# Altium schematic sheet Connectors.SchDoc
size 420 x 297 mm
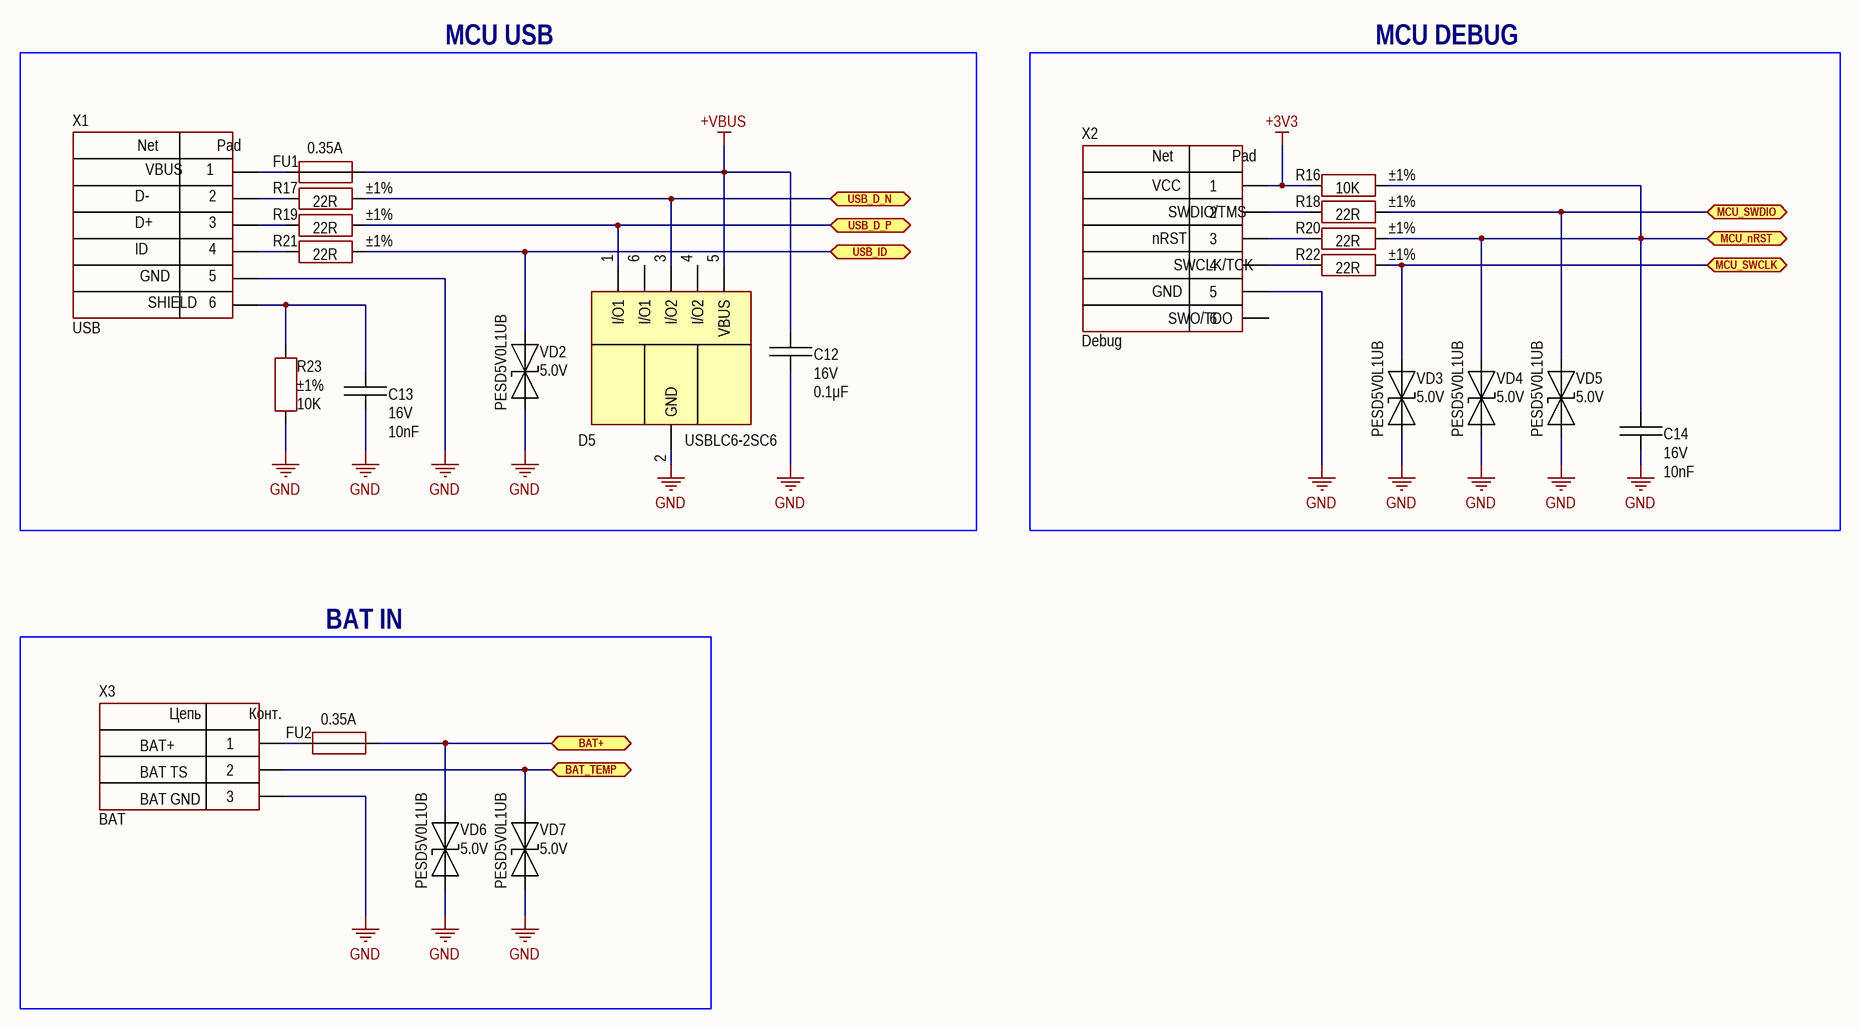
[diagram p0: Connectors.SchDoc]

## Parts
C12  value 0.1μF  Voltage: 16V  [CAP: 0402_NO_SILK]
C13  value 10nF  Voltage: 16V  [CAP: 0201]
C14  value 10nF  Voltage: 16V  [CAP: 0201]
D5  (no value)  [SOT23-6]
FU1  MaxCurrent: 0.35A  [FUSE 0402]
FU2  MaxCurrent: 0.35A  [FUSE 0402]
R16  value 10K  Tolerance: ±1%  [RES: 0201]
R17  value 22R  Tolerance: ±1%  [RES: 0201]
R18  value 22R  Tolerance: ±1%  [RES: 0201]
R19  value 22R  Tolerance: ±1%  [RES: 0201]
R20  value 22R  Tolerance: ±1%  [RES: 0201]
R21  value 22R  Tolerance: ±1%  [RES: 0201]
R22  value 22R  Tolerance: ±1%  [RES: 0201]
R23  value 10K  Tolerance: ±1%  [RES: 0201]
VD2  Voltage: 5.0V  PartNumber: PESD5V0L1UB  [DIODE: SOD523]
VD3  Voltage: 5.0V  PartNumber: PESD5V0L1UB  [DIODE: SOD523]
VD4  Voltage: 5.0V  PartNumber: PESD5V0L1UB  [DIODE: SOD523]
VD5  Voltage: 5.0V  PartNumber: PESD5V0L1UB  [DIODE: SOD523]
VD6  Voltage: 5.0V  PartNumber: PESD5V0L1UB  [DIODE: SOD523]
VD7  Voltage: 5.0V  PartNumber: PESD5V0L1UB  [DIODE: SOD523]
X1  CommentText: USB  [CON: USB micro-A (ZX62-B-5PA)]
X2  CommentText: Debug  [CON: TC2030-IDC-NL]
X3  CommentText: BAT  [CON: WF-03]

## Blocks framed on the sheet
MCU USB: C12 C13 D5 FU1 R17 R19 R21 R23 VD2 X1
MCU DEBUG: C14 R16 R18 R20 R22 VD3-VD5 X2
BAT IN: FU2 VD6 VD7 X3

## Ports
BAT+ (bidir), BAT_TEMP (bidir), MCU_nRST (bidir), MCU_SWCLK (bidir), MCU_SWDIO (bidir), USB_D_N (bidir), USB_D_P (bidir), USB_ID (bidir)

## Nets
+3V3: R16.2 X2.1
+VBUS: C12.2 D5.5(VBUS) FU1.2
GND: C12.1 C13.1 C14.1 D5.2(GND) R23.1 VD2.1(A) VD3.1(A) VD4.1(A) VD5.1(A) VD6.1(A) VD7.1(A) X1.5 X2.5 X3.3
BAT+: FU2.2 VD6.2(C) ; port BAT+
BAT_TEMP: VD7.2(C) X3.2 ; port BAT_TEMP
MCU_nRST: C14.2 R16.1 R20.2 VD4.2(C) ; port MCU_nRST
MCU_SWCLK: R22.2 VD3.2(C) ; port MCU_SWCLK
MCU_SWDIO: R18.2 VD5.2(C) ; port MCU_SWDIO
USB_D_N: D5.3(I/O2) R17.2 ; port USB_D_N
USB_D_P: D5.1(I/O1) R19.2 ; port USB_D_P
USB_ID: R21.2 VD2.2(C) ; port USB_ID
NetC13_2: C13.2 R23.2 X1.0
NetFU1_1: FU1.1 X1.1
NetFU2_1: FU2.1 X3.1
NetR17_1: R17.1 X1.2
NetR18_1: R18.1 X2.2
NetR19_1: R19.1 X1.3
NetR20_1: R20.1 X2.3
NetR21_1: R21.1 X1.4
NetR22_1: R22.1 X2.4

Not connected (* = marked no-connect by the designer): D5 4(I/O2) 6(I/O1); X2 6

## Notes on the sheet
- BAT+
- BAT TS
- BAT GND
- Author
- Manufacturer
- Date
- Page
- Total pages
- Size page
- A3
- Materials
- (in symbol Connector_USB_micro_B) Net; Pad; VBUS; D-; D+; ID; GND; SHIELD; 6
- (in symbol TC2030-IDC-NL) Net; Pad; VCC; SWDIO/TMS; nRST; SWCLK/TCK; GND; SWO/TDO
- (in symbol WF-3) Цепь; Конт.

## Library data of the parts
C12 = Ceramic_0402: 0.1 µF ±10% 16V Ceramic Capacitor X7R 0402 (1005 Metric); Manufacturer: Yageo; PartNumber: CC0402KRX7R7BB104; ValueManufacturerPartNumber: Ceramic capacitor, 0.1μF, X7R, ±10%, 16V, 0402, -55...+125°C; Package: 0402; HelpURL: https://www.digikey.com/product-detail/en/yageo/CC0402KRX7R7BB104/311-1338-1-ND/2103122; Temperature: -55...+125°C; TypeCapacitor: Ceramic capacitor; Tolerance: ±10%; TypeDielectric: X7R
C13 C14 = Ceramic_0201: 10000 pF ±10% 16V Ceramic Capacitor X7R 0201 (0603 Metric); Manufacturer: Yageo; PartNumber: CC0201KRX7R7BB103; ValueManufacturerPartNumber: Ceramic capacitor, 10nF, X7R, ±10%, 16V, 0201, -55...+125°C; Package: 0201; HelpURL: https://www.digikey.com/en/products/detail/yageo/CC0201KRX7R7BB103/2833569; Temperature: -55...+125°C; TypeCapacitor: Ceramic capacitor; Tolerance: ±10%; TypeDielectric: X7R
D5 = USBLC6-2SC6: ESD diode array; Manufacturer: STMicroelectronics; TypeDiode: USB protection; Current: 5A peak; VoltageDrop: 17V; RecoveryTime: Power line; Package: SOT-23-6; HelpURL: https://www.digikey.com/product-detail/en/stmicroelectronics/USBLC6-2SC6/497-5235-1-ND/1121688; ValueManufacturerPartNumber: =TypeDiode+', '+Voltage+', '+Current+', '+VoltageDrop+', '+RecoveryTime+', '+Package+', '+Temperature; Temperature: -40...+125°C; PartNumber: USBLC6-2SC6
FU1 FU2 = Fuse: Polymeric PTC Resettable Fuse 6V 350 mA Ih Surface Mount 0402 (1005 Metric), Concave; Manufacturer: Bourns; PartNumber: MF-ASML035/6-2; VoltageMax: 250VAC; Package: 0402; HelpURL: https://www.digikey.com/en/products/detail/bourns-inc/MF-ASML035-6-2/10268609; ValueManufacturerPartNumber: =TypeFuse+', '+VoltageMax+', '+MaxCurrent+', '+Package+', '+Temperature; TypeFuse: PTC
R16 R23 = Resistor_0201: 10 kOhms ±1% 0.05W, 1/20W Chip Resistor 0201 (0603 Metric) Moisture Resistant Thick Film; Manufacturer: Yageo; PartNumber: RC0201JR-0710KL; ValueManufacturerPartNumber: Resistor film, 10K, ±1%, 0201, 0.05W, -55...+125°C; TypeResistor: Resistor film; Package: 0201; HelpURL: https://www.digikey.com/en/products/detail/yageo/RC0201FR-0710KL/1948870; Temperature: -55...+125°C; Power: 0.05W
R17-R22 = Resistor_0201: 22 Ohms ±1% 0.05W, 1/20W Chip Resistor 0201 (0603 Metric) Moisture Resistant Thick Film; Manufacturer: Yageo; PartNumber: RC0201FR-0722RL; ValueManufacturerPartNumber: Resistor film, 22R, ±1%, 0201, 0.05W, -55...+125°C; TypeResistor: Resistor film; Package: 0201; HelpURL: https://www.digikey.com/en/products/detail/yageo/RC0201FR-0722RL/5280378; Temperature: -55...+125°C; Power: 0.05W
VD2-VD7 = TVS_single: 12V Clamp 3.5A (8/20µs) Ipp Tvs Diode Surface Mount SOD-523; Manufacturer: Nexperia; TypeDiode: ESD TVS diode; Package: SOD-523; HelpURL: https://www.digikey.com/en/products/detail/nexperia-usa-inc/PESD5V0L1UB115/2092297; ValueManufacturerPartNumber: =TypeDiode+', '+Voltage+', '+Current+', '+VoltageDrop+', '+RecoveryTime+', '+Package+', '+Temperature; Temperature: -55...+150°C; Current: 3.5A
X1 = Connector_USB_micro_B: USB-micro; Manufacturer: Hirose Electric; ValueManufacturerPartNumber: USB micro B; PartNumber: ZX62-B-5PA; HelpURL: https://www.digikey.com/product-detail/en/hirose-electric-co-ltd/ZX62-B-5PA/H11579CT-ND/1851090; TypeConnector: USB micro B
X2 = TC2030-IDC-NL: Tag-connect TC2030-IDC-NL debug footprint; TypeConnector: Debug connector; Multichannel: 6pin; Manufacturer: Tag-Connect; HelpURL: http://www.klsele.com/products/Terminal-blocks/560/278.html; ValueManufacturerPartNumber: =TypeConnector+', '+Multichannel+', '+Pitch+', '+VoltageMax+', '+CurrentMax; PartNumber: TC2030-IDC-NL
X3 = WF-3: Manufacturer: Connfly; ValueManufacturerPartNumber: Connector, 3pin, 2.54mm, 250VAC, 3A; TypeConnector: Connector; VoltageMax: 250VAC; Pitch: 2.54mm; CurrentMax: 3A; Multichannel: 3pin; HelpURL: https://www.chipdip.ru/product/wf-3; PartNumber: WF-3